# EAGLE schematic principal (EAGLE 7.3.0)
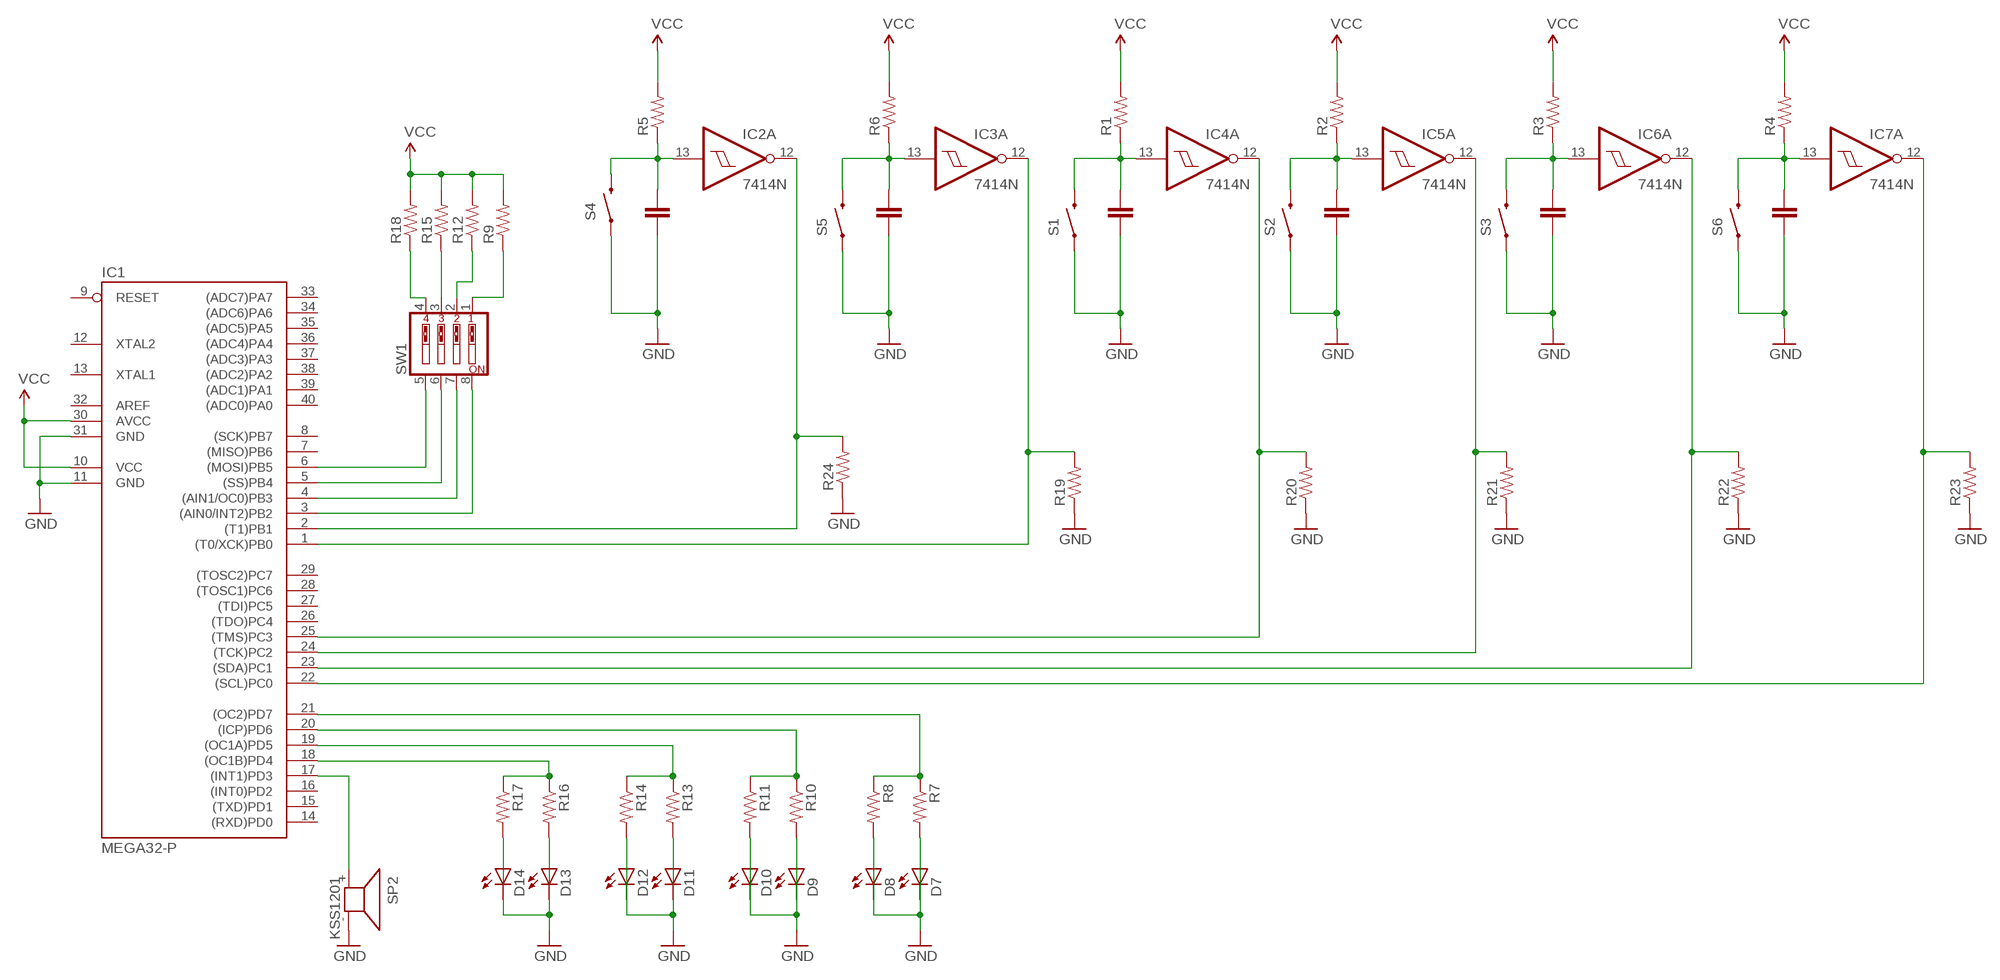
[diagram p0: schematic, sheet 1]

## Parts
D7  LED5MM  [LED5MM]
D8  LED5MM  [LED5MM]
D9  LED5MM  [LED5MM]
D10  LED5MM  [LED5MM]
D11  LED5MM  [LED5MM]
D12  LED5MM  [LED5MM]
D13  LED5MM  [LED5MM]
D14  LED5MM  [LED5MM]
IC1  MEGA32-P  [DIL40]
IC2  7414N  [DIL14]
IC3  7414N  [DIL14]
IC4  7414N  [DIL14]
IC5  7414N  [DIL14]
IC6  7414N  [DIL14]
IC7  7414N  [DIL14]
R1  R-US_0204/5  [0204/5]
R2  R-US_0204/5  [0204/5]
R3  R-US_0204/5  [0204/5]
R4  R-US_0204/5  [0204/5]
R5  R-US_0204/5  [0204/5]
R6  R-US_0204/5  [0204/5]
R7  R-US_0204/5  [0204/5]
R8  R-US_0204/5  [0204/5]
R9  R-US_0204/5  [0204/5]
R10  R-US_0204/5  [0204/5]
R11  R-US_0204/5  [0204/5]
R12  R-US_0204/5  [0204/5]
R13  R-US_0204/5  [0204/5]
R14  R-US_0204/5  [0204/5]
R15  R-US_0204/5  [0204/5]
R16  R-US_0204/5  [0204/5]
R17  R-US_0204/5  [0204/5]
R18  R-US_0204/5  [0204/5]
R19  R-US_0204/5  [0204/5]
R20  R-US_0204/5  [0204/5]
R21  R-US_0204/5  [0204/5]
R22  R-US_0204/5  [0204/5]
R23  R-US_0204/5  [0204/5]
R24  R-US_0204/5  [0204/5]
S1  SWITCH-MOMENTARY-2PTH  [TACTILE-PTH]
S2  SWITCH-MOMENTARY-2PTH  [TACTILE-PTH]
S3  SWITCH-MOMENTARY-2PTH  [TACTILE-PTH]
S4  SWITCH-MOMENTARY-2PTH  [TACTILE-PTH]
S5  SWITCH-MOMENTARY-2PTH  [TACTILE-PTH]
S6  SWITCH-MOMENTARY-2PTH  [TACTILE-PTH]
SP2  KSS1201  [KSS1201]
SW1  SW_DIP-4  [EDG-04]

## Nets
GND: D7.A D8.A D9.A D10.A D11.A D12.A D13.A D14.A IC1.11(GND) IC1.31(GND) R19.1 R20.1 R21.1 R22.1 R23.1 R24.1 S1.1 S2.1 S3.1 S4.1 S5.1 S6.1 SP2.-
N$1: IC4.13(A:I) R1.1 S1.3
N$2: IC5.13(A:I) R2.1 S2.3
N$3: IC6.13(A:I) R3.1 S3.3
N$4: IC7.13(A:I) R4.1 S6.3
N$5: IC1.22((SCL)PC0) IC7.12(A:O) R23.2
N$6: IC1.25((TMS)PC3) IC4.12(A:O) R20.2
N$7: IC1.24((TCK)PC2) IC5.12(A:O) R21.2
N$8: D7.K(C) R7.2
N$9: D8.K(C) R8.2
N$10: IC2.13(A:I) R5.1 S4.3
N$11: IC1.23((SDA)PC1) IC6.12(A:O) R22.2
N$12: IC1.2((T1)PB1) IC2.12(A:O) R24.2
N$13: IC1.21((OC2)PD7) R7.1 R8.1
N$14: IC1.3((AIN0/INT2)PB2) SW1.8
N$15: D9.K(C) R10.2
N$16: D10.K(C) R11.2
N$17: IC1.20((ICP)PD6) R10.1 R11.1
N$18: IC1.4((AIN1/OC0)PB3) SW1.7
N$19: D11.K(C) R13.2
N$20: D12.K(C) R14.2
N$21: IC1.19((OC1A)PD5) R13.1 R14.1
N$22: IC1.5((SS)PB4) SW1.6
N$23: D13.K(C) R16.2
N$24: D14.K(C) R17.2
N$25: IC1.18((OC1B)PD4) R16.1 R17.1
N$26: IC1.6((MOSI)PB5) SW1.5
N$27: R18.1 SW1.4
N$28: R15.1 SW1.3
N$29: R12.1 SW1.2
N$30: R9.1 SW1.1
N$31: IC3.13(A:I) R6.1 S5.3
N$32: IC1.1((T0/XCK)PB0) IC3.12(A:O) R19.2
N$33: IC1.17((INT1)PD3) SP2.+
VCC: IC1.10(VCC) IC1.30(AVCC) R1.2 R2.2 R3.2 R4.2 R5.2 R6.2 R9.2 R12.2 R15.2 R18.2
Unconnected: IC1.7((MISO)PB6) IC1.8((SCK)PB7) IC1.9(RESET) IC1.12(XTAL2) IC1.13(XTAL1) IC1.14((RXD)PD0) IC1.15((TXD)PD1) IC1.16((INT0)PD2) IC1.26((TDO)PC4) IC1.27((TDI)PC5) IC1.28((TOSC1)PC6) IC1.29((TOSC2)PC7) IC1.32(AREF) IC1.33((ADC7)PA7) IC1.34((ADC6)PA6) IC1.35((ADC5)PA5) IC1.36((ADC4)PA4) IC1.37((ADC3)PA3) IC1.38((ADC2)PA2) IC1.39((ADC1)PA1) IC1.40((ADC0)PA0) IC2.1(D:I) IC2.2(D:O) IC2.3(E:I) IC2.4(E:O) IC2.5(F:I) IC2.6(F:O) IC2.8(C:O) IC2.9(C:I) IC2.10(B:O) IC2.11(B:I) IC3.1(D:I) IC3.2(D:O) IC3.3(E:I) IC3.4(E:O) IC3.5(F:I) IC3.6(F:O) IC3.8(C:O) IC3.9(C:I) IC3.10(B:O) IC3.11(B:I) IC4.1(D:I) IC4.2(D:O) IC4.3(E:I) IC4.4(E:O) IC4.5(F:I) IC4.6(F:O) IC4.8(C:O) IC4.9(C:I) IC4.10(B:O) IC4.11(B:I) IC5.1(D:I) IC5.2(D:O) IC5.3(E:I) IC5.4(E:O) IC5.5(F:I) IC5.6(F:O) IC5.8(C:O) IC5.9(C:I) IC5.10(B:O) IC5.11(B:I) IC6.1(D:I) IC6.2(D:O) IC6.3(E:I) IC6.4(E:O) IC6.5(F:I) IC6.6(F:O) IC6.8(C:O) IC6.9(C:I) IC6.10(B:O) IC6.11(B:I) IC7.1(D:I) IC7.2(D:O) IC7.3(E:I) IC7.4(E:O) IC7.5(F:I) IC7.6(F:O) IC7.8(C:O) IC7.9(C:I) IC7.10(B:O) IC7.11(B:I)

## Power pins joined to a net without a drawn wire
GND: IC2.7(P:GND) IC3.7(P:GND) IC4.7(P:GND) IC5.7(P:GND) IC6.7(P:GND) IC7.7(P:GND)
VCC: IC2.14(P:VCC) IC3.14(P:VCC) IC4.14(P:VCC) IC5.14(P:VCC) IC6.14(P:VCC) IC7.14(P:VCC)

## Library data of the parts
D7-D14 = SparkFun-LED:LED: LEDs Standard schematic elements and footprints for 5mm, 3mm, 1206, and 0603 sized LEDs. 5mm - Spark Fun Electronics SKU : COM-00529 (and others)
IC1 = atmel:MEGA32-P: MICROCONTROLLER 32 Kbytes FLASH 2 Kbytes SRAM 1 Kbytes EEPROM USART 8-channel 10 bit ADC Source: www.atmel.com .. doc2503.pdf; MPN: ATMEGA32-16PU; OC_FARNELL: 1661729; OC_NEWARK: 51P1794
IC2-IC7 = 74xx-eu:74*14: Hex schmitt trigger INVERTER
R1-R24 = resistor:R-US_: RESISTOR, American symbol
S1-S6 = SparkFun-Electromechanical:SWITCH-MOMENTARY-2: Various NO switches- pushbuttons, reed, etc; PROD_ID: SWCH-08441
SP2 = buzzer:KSS1201: SPEAKER Source: Schukat; OC_FARNELL: unknown; OC_NEWARK: unknown
SW1 = special:SW_DIP-4: DIP SWITCH